# Altium schematic sheet Power_Supply.SchDoc
size A; SheetNumber: 4; SheetTotal: 4
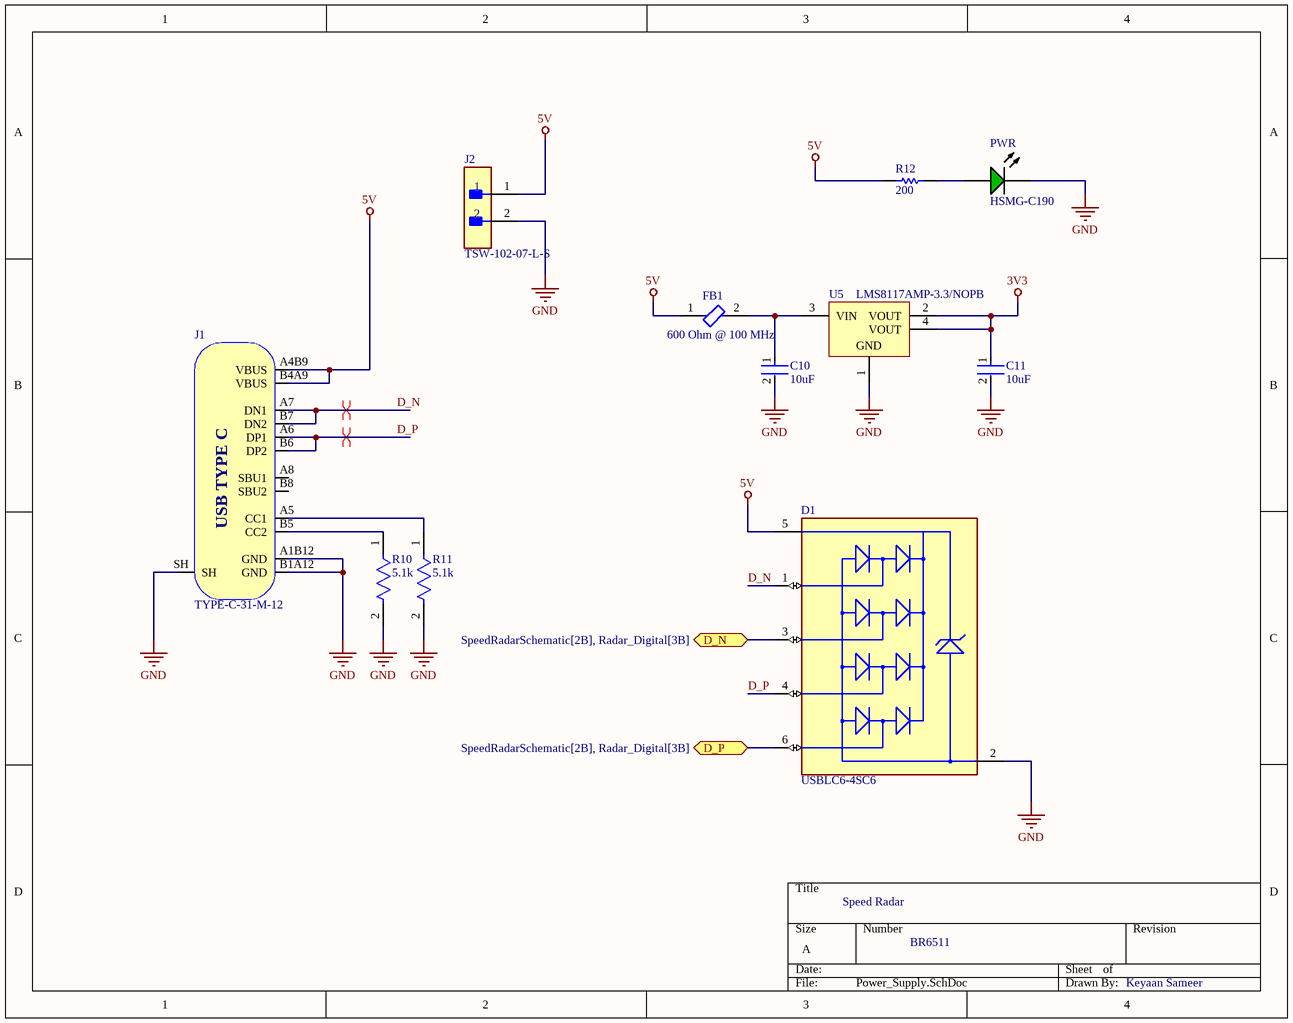
[diagram p0: Power_Supply.SchDoc]

## Parts
C10  10uF  [FP-C0805C106K8RACAUTO-MFG]
C11  10uF  [FP-C0805C106K8RACAUTO-MFG]
D1  USBLC6-4SC6  [FP-SOT23-6L-MFG]
FB1  600 Ohm @ 100 MHz  [FP-BLM18-0_15-t0_8-IPC_B]
J1  TYPE-C-31-M-12  [TYPE-C-31-M-12]
J2  TSW-102-07-L-S  [FP-TSW-102-07-L-S-MFG]
PWR  HSMG-C190  [AVAG-HSMX-C190_V]
R10  5.1k  [KOA_Speer_RN73R1J_MFG]
R11  5.1k  [KOA_Speer_RN73R1J_MFG]
R12  200  [RESC2013X70X40ML20T20]
U5  LMS8117AMP-3.3/NOPB  [DCY0004A_M]

## Ports
D_N (bidir, see SpeedRadarSchematic[2B], Radar_Digital[3B]), D_P (bidir, see SpeedRadarSchematic[2B], Radar_Digital[3B])

## Nets
3V3: C11.1 U5.2(VOUT) U5.4(VOUT)
5V: D1.5(VBUS) FB1.1 J1.A4B9(VBUS) J1.B4A9(VBUS) J2.1 R12.1
GND: C10.2 C11.2 D1.2(GND) J1.A1B12(GND) J1.B1A12(GND) J1.SH J2.2 PWR.2(K) R10.2 R11.2 U5.1(GND)
D_N: D1.1(I/O1) J1.A7(DN1) J1.B7(DN2)
D_N: D1.3(I/O2) ; port D_N  [a separate net that carries the same name]
D_P: D1.4(I/O3) J1.A6(DP1) J1.B6(DP2)
D_P: D1.6(I/O4) ; port D_P  [a separate net that carries the same name]
NetC10_1: C10.1 FB1.2 U5.3(VIN)
NetJ1_A5: J1.A5(CC1) R11.1
NetJ1_B5: J1.B5(CC2) R10.1
NetPWR_1: PWR.1(A) R12.2

Not connected (* = marked no-connect by the designer): J1 A8(SBU1) B8(SBU2)

## Layout directives
differential pair: D_N, D_P

## Notes on the sheet
- Speed Radar
- BR6511
- Keyaan Sameer
- (in symbol CMP-002-00145-2) USB TYPE C

## Library data of the parts
C10 C11 = CMP-03020-034662-1: CAP CER 10UF 10V X7R 0805; Tolerance: 10%; Case/Package: 0805; Ratings: AEC-Q200; Packaging: Tape and Reel; Voltage Rating: 10V; Max Operating Temperature: 125°C; Min Operating Temperature: -55°C; Case Code (Metric): 2012; Case Code (Imperial): 0805; Mount: Surface Mount; RoHS Compliant: Yes; Capacitance: 10uF
D1 = CMP-2000-07370-2: TVS DIODE 5.25V 17V SOT23-6; Manufacturer: STMicroelectronics; Peak Pulse Power: 130W; Breakdown Voltage: 6V; Value: 3pF; Direction: Unidirectional; Interface: USB,Ethernet,Other; Number Of Channels: 4; Standoff Height: 0mm; Max Junction Temp: +125°C; Digikey Description: TVS DIODE 5.25V 17V SOT23-6; Automotive: No; Package: SOT23-6L; Mouser Description: USBLC6 Series 4 Line 6 V Uni / Bi-Directional ESD Protection - SOT-23-6; Octopart: https://octopart.com/usblc6-4sc6-stmicroelectronics-347147; RoHS: TRUE; ComponentLink2URL: https://upverter.com/datasheet/23dc4ffb028d868909e80577610284b194f13213.pdf; ComponentLink2Description: Datasheet; Device Class L1: Circuit Protection; Lead Free: Yes; Temperature Range High: +125°C; Device Class L2: ESD and Circuit Protection ICs; Device Class L3: unset; Capacitance: 3pF; Height: 1.45mm; Temperature Range Low: -40°C; Manufacturer Part Number: USBLC6-4SC6; Temperature: -40°C to +125°C; Category: Diode; Clamping Voltage: 17V
FB1 = CMP-06046-001498-1: Chip Ferrite Bead, 0603, 600Ω @ 100MHz, 0.25Ω, 25%, 800mA
J1 = CMP-002-00145-2: USB Type C Connector Horizontal SMT; Manufacturer: Koren Hroparts; Design Item ID: TYPE-C-31-M-12; System: Connector; Manufacturer Part Number: TYPE-C-31-M-12; Source: Schematic-Lib-PhilsLab.SchLib
J2 = CMP-02766-001428-1: CONN HEADER VERT 2POS 2.54MM; Voltage Rating: 550V; Current Rating: 7.6A; Gender: Male; Number of Contacts: 2; Connector Type: Male Pin; Radiation Hardening: No; Orientation: Straight; Contact Plating: Gold; Max Operating Temperature: 125°C; Mount: Through Hole; Package Quantity: 1; Number of Rows: 1; Housing Material: Polyester; RoHS Compliant: Yes; Length: 5.08mm; Max Voltage Rating (AC): 550V; Pitch: 2.54mm; Packaging: Bulk; Depth: 2.54mm; Termination: Solder; Min Operating Temperature: -55°C; Housing Color: Black; Lead Free: Lead Free; Color: Black; Number of Positions: 2; Width: 2.54mm; Max Current Rating: 7.6A; REACH SVHC: No SVHC; Contact Material: Bronze; Contact Mating Length: 0.23inch; Series: TSW; Contact Type: Male Pin
PWR = CMP-007-00013-2: LED Uni-Color Green, 52 mW, 20 mA, -40 to 85 degC, 2-Pin SMD, RoHS, Tape and Reel; Manufacturer: Avago; Forward Current: 20mA; Viewing Angle: 170degrees; Luminous Intensity: 15mcd; Lens Style: Diffused; Forward Voltage: 2.2V; Power: 52mW; Mounting Technology: SM; RoHS Compliant: True; Packaging: TapeandReel; Illumination Colour: Green; Datasheet URL: http://docs.avagotech.com/docs/AV02-0551EN; Min Operating Temperature: -40°C; Max Operating Temperature: 85°C; Pins: 2; Package Description: 2-Pin Surface Mount Device, Body 1.6 x 0.8 mm, Height 0.9 mm; Nominal Vf: 2.2V; Case/Package: 0603; Manufacturer URL: http://www.avagotech.com/; Datasheet Version: Mar-12; Colour: Green; Package Reference: HSMX-C190; Package Quantity: 4000
R10 R11 = CMP-00683-99548008-1: RN73R1JTTD5101B25 Res, 5K1, 0.1%, 0.1W, 0603 Rohs Compliant: Yes; Power Rating: 100mW; Resistance: 5.1kΩ; Temperature Coefficient: 25ppm/°C; Voltage Rating: 75V; Min Operating Temperature: -55°C; Case/Package: 0603; Height: 550µm; Composition: Thin Film; Max Operating Temperature: 155°C; NexarPartId: 99548008; Tolerance: 0.1%; Ambient Temperature Range High: 85°C
R12 = CMP-2001-00025-1: Manufacturer: Panasonic; Part Number: ERJ-6ENF2000V
U5 = CMP-019-00008-3: Low-Dropout Linear Regulator, 1 A, 3.3 V, 0 to 125 degC, 4-Pin SOT223 (DCY), RoHS, Tape and Reel; Manufacturer: Texas Instruments; Min Input Voltage: 2.5V; Min Supply Voltage: 3.2V; Max Supply Voltage: 15V; Outputs: 1; Output Current: 1A; Nominal Supply Current: 5mA; Dropout Voltage: 1.2V; Output Voltage: 3.3V; Datasheet URL: http://www.ti.com/lit/ds/symlink/lms8117a.pdf; Manufacturer URL: http://www.ti.com/; Package Reference: DCY0004A; Max Operating Temperature: 125°C; Datasheet Version: SNOS487F, 05/2004; Max Input Voltage: 15V; Mounting Technology: SM; Package Description: 4-Pin Small Outline Transistor, Body 6.5 x 3.5 mm, Pitch 2.3 mm; Pins: 4; Package Quantity: 1000; Packaging: TapeandReel; RoHS Compliant: True; Min Operating Temperature: 0°C; Case/Package: SOT-223; Max Ouput Current: 1A